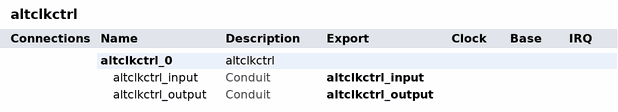
[diagram p0: system contents]
# Platform Designer (Qsys) system altclkctrl, Cyclone IV E EP4CE6E22C8
# Parameters at their usual value, and those the tool derives, are not listed.
package require qsys
create_system altclkctrl
set_project_property DEVICE_FAMILY {Cyclone IV E}
set_project_property DEVICE EP4CE6E22C8

add_instance altclkctrl_0 altclkctrl 24.1
set_instance_property altclkctrl_0 AUTO_EXPORT true
set_instance_parameter_value altclkctrl_0 CLOCK_TYPE 1
set_instance_parameter_value altclkctrl_0 ENA_REGISTER_MODE 1
set_instance_parameter_value altclkctrl_0 GUI_USE_ENA false
set_instance_parameter_value altclkctrl_0 NUMBER_OF_CLOCKS 1
set_instance_parameter_value altclkctrl_0 USE_GLITCH_FREE_SWITCH_OVER_IMPLEMENTATION false

# exported interfaces
add_interface altclkctrl_input conduit end
set_interface_property altclkctrl_input EXPORT_OF altclkctrl_0.altclkctrl_input
add_interface altclkctrl_output conduit end
set_interface_property altclkctrl_output EXPORT_OF altclkctrl_0.altclkctrl_output

set_interconnect_requirement {$system} qsys_mm.clockCrossingAdapter HANDSHAKE
set_interconnect_requirement {$system} qsys_mm.enableEccProtection FALSE
set_interconnect_requirement {$system} qsys_mm.insertDefaultSlave FALSE
set_interconnect_requirement {$system} qsys_mm.maxAdditionalLatency 1

save_system altclkctrl.qsys
